# EAGLE schematic mux_cable (EAGLE 9.6.2)
COMPANY: ADAFRUIT INDUSTRIES; DRAWN: KTOWN; REV: A
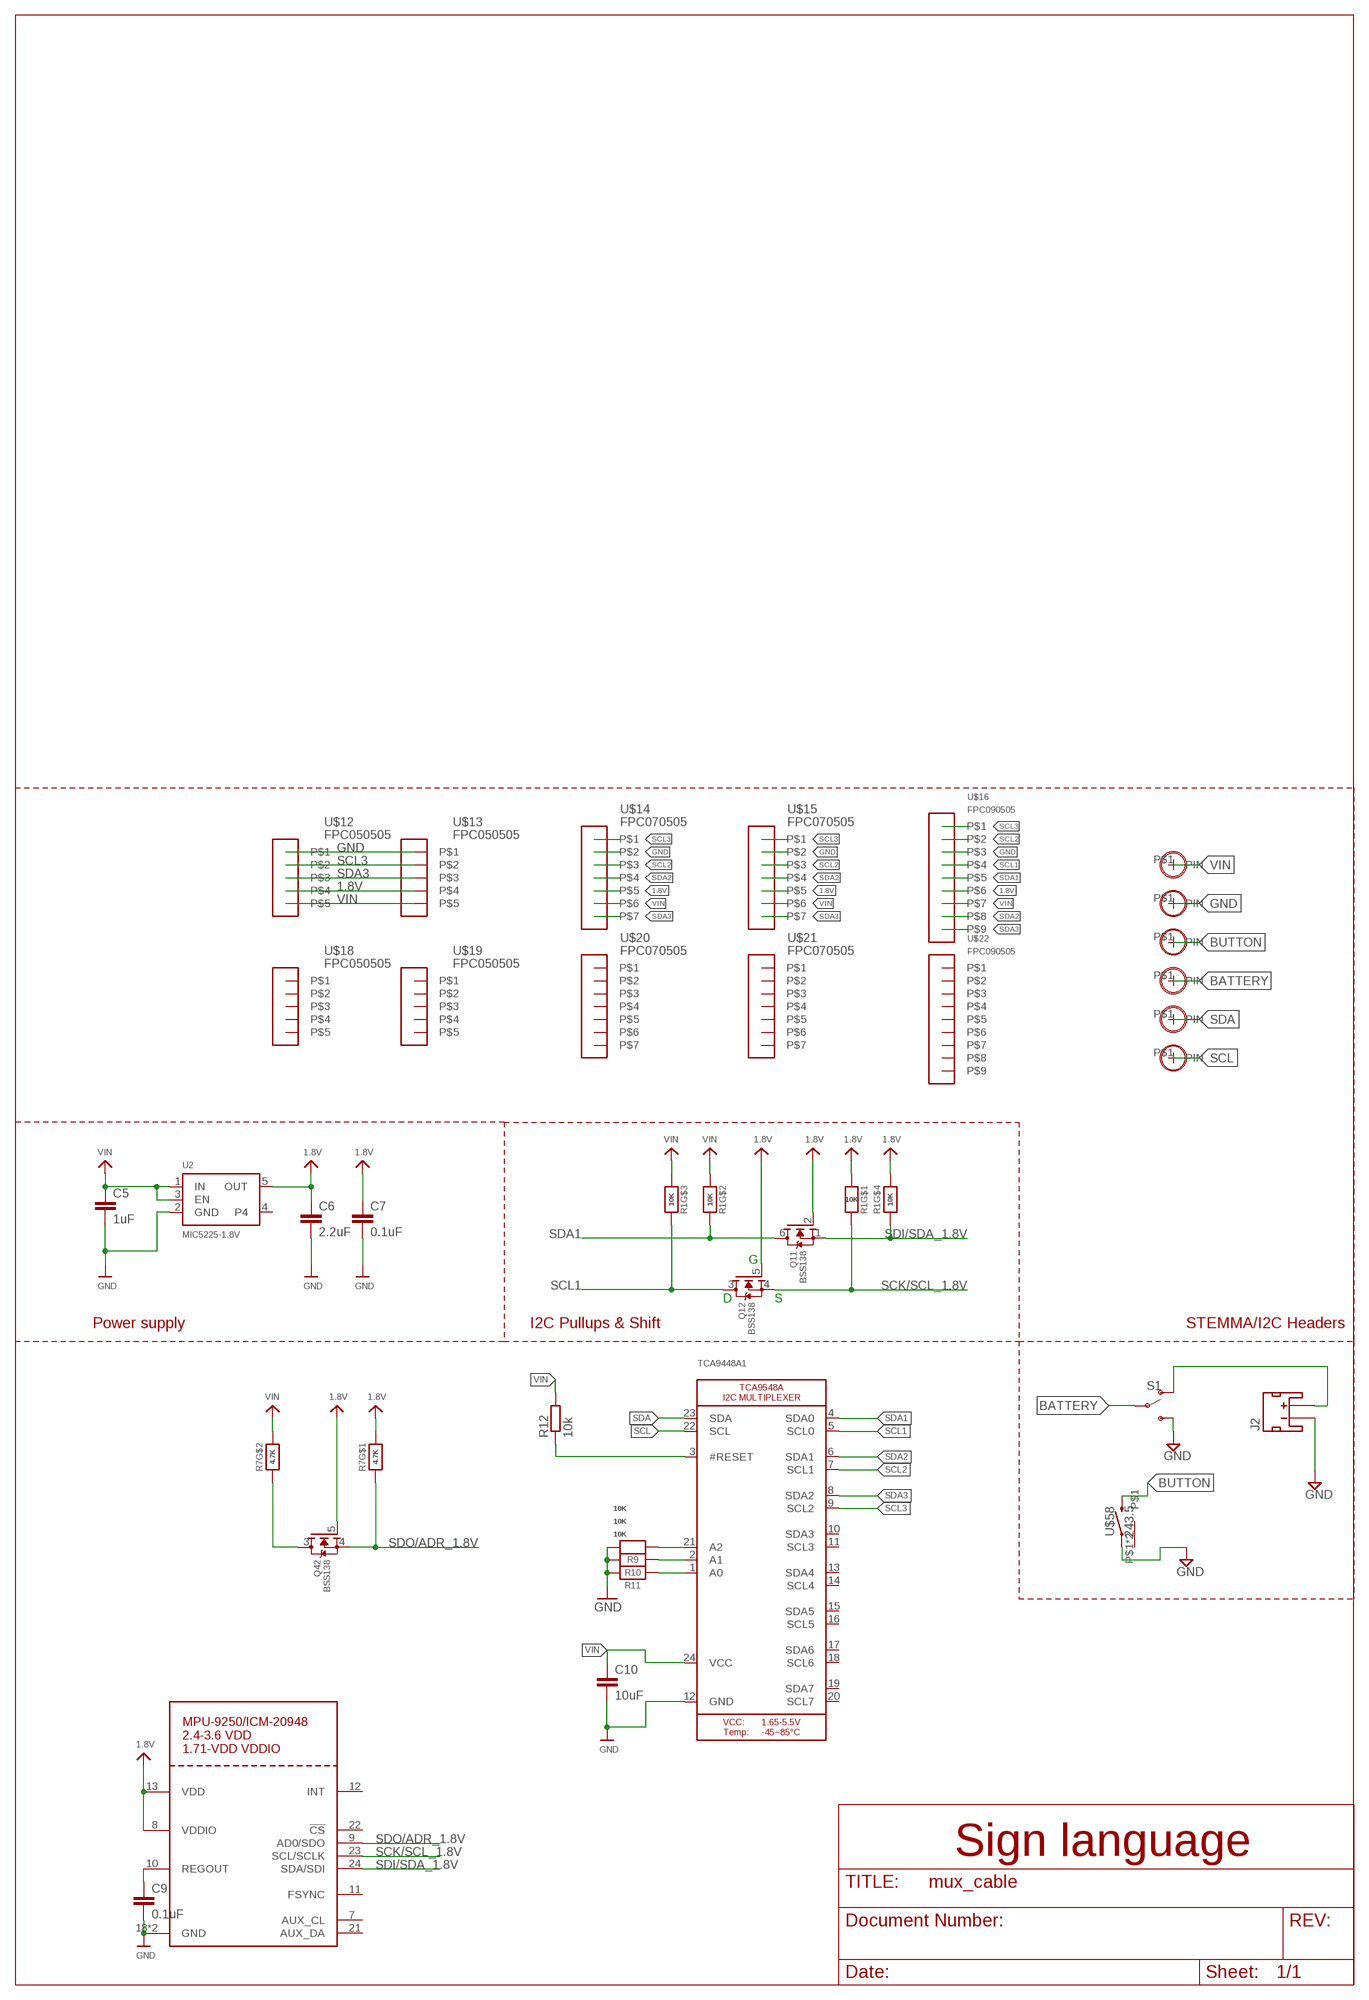
[diagram p0: schematic, sheet 1]

## Parts
C5  1uF  C-EUC0402  [C0402]
C6  2.2uF  C-EUC0402  [C0402]
C7  0.1uF  C-EUC0402  [C0402]
C9  0.1uF  C-EUC0402  [C0402]
C10  10uF  C-EUC0402  [C0402]
J2  JST_2MM_MALE  [JST-2-SMD]
Q1  BSS138  MOSFET-N_DUAL  [SOT363]
Q4  BSS138  MOSFET-N_DUAL  [SOT363]
R1  10K  RESISTOR_4PACK  [RESPACK_4X0603]
R7  4.7K  RESISTOR_4PACK  [RESPACK_4X0603]
R9  10K  RESISTOR0805_NOOUTLINE  [0805-NO]
R10  10K  RESISTOR0805_NOOUTLINE  [0805-NO]
R11  10K  RESISTOR0805_NOOUTLINE  [0805-NO]
R12  10k  R-EU_R0805  [R0805]
S1  SWITCH-SPDT-SMD-RIGHT-ANGLE  [SWITCH_SPST_SMD_A]
TCA9448A1  MICROBUILDER_TCA9548A  [MICROBUILDER_TSSOP24]
U2  MIC5225-1.8V  VREG_SOT23-5  [SOT23-5]
U$12  FPC050505  [FPC0505]
U$13  FPC050505  [FPC0505]
U$14  FPC070505  [FPC0705]
U$15  FPC070505  [FPC0705]
U$16  FPC090505  [FPC0905]
U$18  FPC050505  [FPC0505]
U$19  FPC050505  [FPC0505]
U$20  FPC070505  [FPC0705]
U$21  FPC070505  [FPC0705]
U$22  FPC090505  [FPC0905]
U$39  MPU-9250_ICM20948  [QFN24_3MM_NOEP]
U$58  243.5  [2*4*3.5]
U$59  M0.9-HOLE0.9MM  [M0.9-HOLE]
U$60  M0.9-HOLE0.9MM  [M0.9-HOLE]
U$61  M0.9-HOLE0.9MM  [M0.9-HOLE]
U$62  M0.9-HOLE0.9MM  [M0.9-HOLE]
U$63  M0.9-HOLE0.9MM  [M0.9-HOLE]
U$64  M0.9-HOLE0.9MM  [M0.9-HOLE]

## Nets
1.8V: C6.1 C7.1 Q1.2(1:G) Q1.5(2:G) Q4.5(2:G) R1.4 R1.8 R7.8 U2.5(OUT) U$12.P$4 U$13.P$4 U$14.P$5 U$15.P$5 U$16.P$6 U$39.8(VDDIO) U$39.13(VDD)
BATTERY: S1.2(P) U$62.P$1(PIN)
BUTTON: U$58.P$4 U$61.P$1(PIN)
GND: C5.2 C6.2 C7.2 C9.2 C10.2 J2.1(-) R9.2 R10.2 R11.2 S1.3(S) TCA9448A1.12(GND) U2.2(GND) U$12.P$1 U$13.P$1 U$14.P$2 U$15.P$2 U$16.P$3 U$39.18(GND) U$39.20(GND) U$58.P$3 U$60.P$1(PIN)
N$1: J2.2(+) S1.1(O)
N$6: R9.1 TCA9448A1.21(A2)
N$7: R10.1 TCA9448A1.2(A1)
N$8: R11.1 TCA9448A1.1(A0)
REGOUT1: C9.1 U$39.10(REGOUT)
RESET1: R12.1 TCA9448A1.3(#RESET)
SCK/SCL_1.8V: Q1.4(2:S) R1.1 U$39.23(SCL/SCLK)
SCL: TCA9448A1.22(SCL) U$64.P$1(PIN)
SCL1: Q1.3(2:D) R1.6 TCA9448A1.5(SCL0) U$16.P$4
SCL2: TCA9448A1.7(SCL1) U$14.P$3 U$15.P$3 U$16.P$2
SCL3: TCA9448A1.9(SCL2) U$12.P$2 U$13.P$2 U$14.P$1 U$15.P$1 U$16.P$1
SDA: TCA9448A1.23(SDA) U$63.P$1(PIN)
SDA1: Q1.6(1:D) R1.7 TCA9448A1.4(SDA0) U$16.P$5
SDA2: TCA9448A1.6(SDA1) U$14.P$4 U$15.P$4 U$16.P$8
SDA3: TCA9448A1.8(SDA2) U$12.P$3 U$13.P$3 U$14.P$7 U$15.P$7 U$16.P$9
SDI/SDA_1.8V: Q1.1(1:S) R1.5 U$39.24(SDA/SDI)
SDO/ADR1: Q4.3(2:D) R7.2
SDO/ADR_1.8V: Q4.4(2:S) R7.1 U$39.9(AD0/SDO)
VIN: C5.1 C10.1 R1.2 R1.3 R7.7 R12.2 TCA9448A1.24(VCC) U2.1(IN) U2.3(EN) U$12.P$5 U$13.P$5 U$14.P$6 U$15.P$6 U$16.P$7 U$59.P$1(PIN)
Unconnected: J2.NC1(PAD1) J2.NC2(PAD2) Q4.1(1:S) Q4.2(1:G) Q4.6(1:D) R7.3 R7.4 R7.5 R7.6 TCA9448A1.10(SDA3) TCA9448A1.11(SCL3) TCA9448A1.13(SDA4) TCA9448A1.14(SCL4) TCA9448A1.15(SDA5) TCA9448A1.16(SCL5) TCA9448A1.17(SDA6) TCA9448A1.18(SCL6) TCA9448A1.19(SDA7) TCA9448A1.20(SCL7) U2.4 U$18.P$1 U$18.P$2 U$18.P$3 U$18.P$4 U$18.P$5 U$19.P$1 U$19.P$2 U$19.P$3 U$19.P$4 U$19.P$5 U$20.P$1 U$20.P$2 U$20.P$3 U$20.P$4 U$20.P$5 U$20.P$6 U$20.P$7 U$21.P$1 U$21.P$2 U$21.P$3 U$21.P$4 U$21.P$5 U$21.P$6 U$21.P$7 U$22.P$1 U$22.P$2 U$22.P$3 U$22.P$4 U$22.P$5 U$22.P$6 U$22.P$7 U$22.P$8 U$22.P$9 U$39.7(AUX_CL) U$39.11(FSYNC) U$39.12(INT) U$39.21(AUX_DA) U$39.22(!CS) U$58.P$1 U$58.P$2

## Notes on the sheet
- G
- D | S
- Power supply | I2C Pullups & Shift | STEMMA/I2C Headers
- Sign language

## Library data of the parts
C5-C7 C9 C10 = rcl:C-EU: CAPACITOR, European symbol; SPICEPREFIX: C
J2 = SparkFun-Connectors:JST_2MM_MALE: JST 2MM MALE RA CONNECTOR Two pin, compact surface mount connector. Commonly used as a battery input connection point. We really like the solid locking feeling and high current rating on these small connectors. We use these all the time as battery connectors. Mates to single-cell LiPo batteries. Here is the connector we sell at SparkFun: JST Right Angle Connector - White <https://www.sparkfun.com/products/8612> (PRT-08612) Datasheet <http://www.sparkfun.com/datasheets/Prototyping/Connectors/JST-Horizontal.pdf> It was used on these SparkFun products: SparkFun MOSFET Power Controller <https://www.sparkfun.com/products/11214> (PRT-11214) SparkFun Battery Babysitter - LiPo Battery Manager <https://www.sparkfun.com/products/13777> (PRT-13777) And many, many others that required a lipo battery connection.; PROD_ID: CONN-11443; SF_ID: PRT-08612
Q1 Q4 = microbuilder:MOSFET-N_DUAL: Dual N-Channel MOSFET SOT363 (2.0x1.25mm) 2N7002PS - 60V, 320mA [Digikey: 568-5984-1-ND]
R1 R7 = microbuilder:RESISTOR_4PACK: Resistor Packs (4 resistors) 4 x 0603 10K 1/16W - Digikey: YC164J-10KCT-ND
R9-R11 = microbuilder:RESISTOR: Resistors For new designs, use the packages preceded by an '_' character since they are more reliable: The following footprints should be used on most boards: _0402 - Standard footprint for regular board layouts _0603 - Standard footprint for regular board layouts _0805 - Standard footprint for regular board layouts _1206 - Standard footprint for regular board layouts For extremely tight-pitch boards where space is at a premium, the following 'micro-pitch' footprints can be used (smaller pads, no silkscreen outline, etc.): _0402MP - Micro-pitch footprint for very dense/compact boards _0603MP - Micro-pitch footprint for very dense/compact boards _0805MP - Micro-pitch footprint for very dense/compact boards _1206MP - Micro-pitch footprint for very dense/compact boards
R12 = rcl:R-EU_: RESISTOR, European symbol; SPICEPREFIX: R
S1 = SparkFun-Switches:SWITCH-SPDT: Single Pole, Double Throw (SPDT) Switch Single-pole, double-throw (SPDT) switch. Variant Overview SMD-AYZ0202 Surface Mount DPDT Switch <https://www.sparkfun.com/products/597> (COM-00597) Used on e.g. LilyPad Arduino USB - ATmega32U4 Board <https://www.sparkfun.com/products/12049> PTH-11.6X4.0MM SPDT Mini Power Switch <https://www.sparkfun.com/products/102> (COM-00102) Used on e.g. SparkFun Simon Says - Through-Hole Soldering Kit <https://www.sparkfun.com/products/10547> (KIT-10547) PTH-11.6X4.0MM-KIT KIT version of SPDT Mini Power Switch - Simplifies soldering by removing tStop of switch pins - only one side can be soldered. PTH-11.6X4.0MM-LOCK LOCK version of SPDT Mini Power Switch - Offset pins hold switch in place for easier soldering. SMD-RIGHT-ANGLE Surface Mount Right Angle Switch <https://www.sparkfun.com/products/10860> (COM-10860) Used on e.g. SparkFun ESP8266 Thing <https://www.sparkfun.com/products/13231>; PROD_ID: SWCH-10651; SF_SKU: COM-10860
TCA9448A1 = Adafruit TCA9548A:MICROBUILDER_TCA9548A: TCA9548A I2C Multiplexer
U2 = microbuilder:VREG_SOT23-5: SOT23-5 Fixed Voltage Regulators Part Current Out V Out V In V Dropout θJA (°C/W) TJ (°C) Digikey Part No. ADP121 150mA 3.3V 3.4-5.5V 0.09V @ 150mA -- -- ADP121-AUJZ33R7CT-ND ADP121 150mA 3.0V 3.1-5.5V 0.09V @ 150mA -- -- ADP121-AUJZ30R7CT-ND ADP122 300mA 3.3V 3.4-5.5V 0.085V @ 300mA -- -- ADP122AUJZ-3.3-R7CT-ND ADP1712 300mA 3.3V 3.5-5.5V 0.17V @ 300mA -- -- ADP1712AUJZ-3.3-R7TR-ND AP7311 (Low Cost) 150mA 3.3V 3.5-6V 0.15V @ 150mA -- -- AP7311-33WG-7DICT-ND LD39015M18R 150mA 1.8V 1.9V-5.5V 0.08V @ 100mA -- -- 497-6977-1-ND LP2985A-33DBVR 150mA 3.3V 3.3-16V 0.28V @ 150mA 206 150 296-18479-1-ND MCP1824T-3302E/OT 300mA 3.3V 3.5V-6V 0.2V @ 300mA -- -- MCP1824T-3302E/OTCT-ND MIC5205-2.5YM5 TR 150mA 2.5V 2.7-16V 0.165V @ 150mA -- -- 576-1257-2-ND MIC5205-3.0YM5 TR 150mA 3.0V 3.2V-16V 0.165V @ 150mA -- -- 576-1258-2-ND MIC5205-3.3YM5 TR 150mA 3.3V 3.5V-16V 0.165V @ 150mA -- -- 576-1259-2-ND TPS780330220 150mA 3.3V+2.2V 3.6-5.5V 250mV Max -- -- 296-23332-1-ND TDA3663/N1,135 100mA 3.3V 3.5-45V 0.18V @ 50mA -- -- 568-5343-1-ND Max operating temp can be calculated using θJA, TJ (max junction temperature), and power in watts. Set the "Maximum Ambient Temperature" until it reaches TJ ("Max Junction Temperature"), which is the absolute limit for safe use of the regulator: Heat Sink Temperature Calculator <http://www.daycounter.com/Calculators/Heat-Sink-Temperature-Calculator.phtml> For example, With 12V source into a 3.3V LP2985 and a 30mA load, we are dissipating (12V-3.3V) * 0.03A = 0.261W. With a θJA of 206 °C/W, a TJ of 150°C, and 261mW we can safely use the chip without a heat sink up to 75°C (=147.1°C Junction Temperature).
U$12 U$13 U$18 U$19 = my_library:FPC0505
U$14 U$15 U$20 U$21 = my_library:FPC0705
U$16 U$22 = my_library:FPC0905
U$39 = adafruit_sensor:MPU-9250: MPU-9250 3-Axis gyroscope and 3-Axis accelerometer
U$58 = 2x4x3.5sw:2*4*3.5
U$59-U$64 = M3-Hole:M0.9-HOLE

## Net classes
1 highpower: width 0.254 mm, drill 0.483 mm
2 lowpower: width 0.203 mm, drill 0.483 mm